# Altium schematic sheet Arduino_ Connectors.SchDoc: Arduino UNO connectors
size A4; Date: 29-OCT-2015; Author: A.B; CompanyName: STMicroelectronics; Organization: MCD/TOOLS/GNB; Address1: 12, Rue Jules HOROWITZ; Address2: 38019 Grenoble; Address3: FRANCE; DocumentNumber: MB1225; Revision: B-01; SheetNumber: 8; SheetTotal: 13; Project: STM32F769I-DISCO
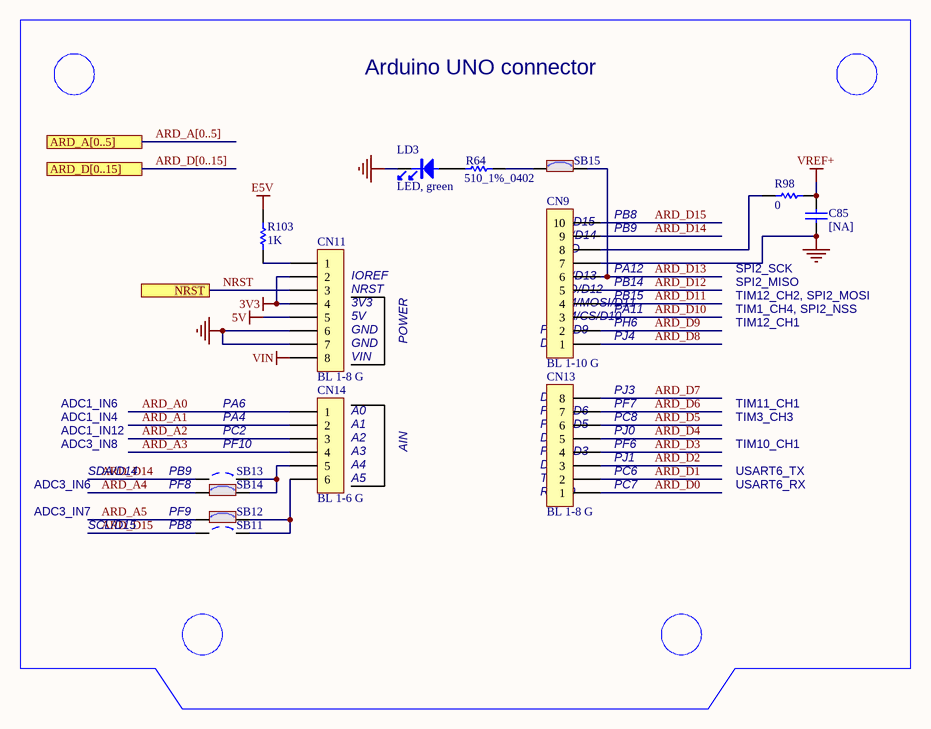
[diagram p0: Arduino_ Connectors.SchDoc]

## Parts
C85  [NA]  [0402C]
CN9  BL 1-10 G  [HDR_1X10_2R54_W]
CN11  BL 1-8 G  [HDR_1X8_2R54_W]
CN13  BL 1-8 G  [HDR_1X8_2R54_W]
CN14  BL 1-6 G  [HDR_1X6_2R54_W]
LD3  LED, green  [0603D]
R64  510_1%_0402  [0402R]
R98  0  [0402R]
R103  1K  [0402R]
SB11  Solder Bridge OFF  [JP2_SMD]  (value not drawn)
SB12  Solder Bridge ON  [JP2_SMD]  (value not drawn)
SB13  Solder Bridge OFF  [JP2_SMD]  (value not drawn)
SB14  Solder Bridge ON  [JP2_SMD]  (value not drawn)
SB15  Solder Bridge ON  [JP2_SMD]  (value not drawn)

## Ports
ARD_A[0..5], ARD_D[0..15], NRST

## Nets
3V3: CN11.2 CN11.4
5V: CN11.5
E5V: R103.2
GND: C85.1 CN9.7 CN11.6 CN11.7 LD3.2
VIN: CN11.8
VREF+: C85.2 R98.2
ARD_A0: CN14.1
ARD_A1: CN14.2
ARD_A2: CN14.3
ARD_A3: CN14.4
ARD_A4: SB14.1
ARD_A5: SB12.1
ARD_D0: CN13.1
ARD_D1: CN13.2
ARD_D2: CN13.3
ARD_D3: CN13.4
ARD_D4: CN13.5
ARD_D5: CN13.6
ARD_D6: CN13.7
ARD_D7: CN13.8
ARD_D8: CN9.1
ARD_D9: CN9.2
ARD_D10: CN9.3
ARD_D11: CN9.4
ARD_D12: CN9.5
ARD_D13: CN9.6 SB15.2
ARD_D14: CN9.9 SB13.1
ARD_D15: CN9.10 SB11.1
NRST: CN11.3 ; port NRST
NetCN9_8: CN9.8 R98.1
NetCN11_1: CN11.1 R103.1
NetCN14_5: CN14.5 SB13.2 SB14.2
NetCN14_6: CN14.6 SB11.2 SB12.2
NetLD3_1: LD3.1 R64.1
NetR64_2: R64.2 SB15.1

## Buses and harness runs
bus ARD_A[0..5] = port ARD_A[0..5]
bus ARD_D[0..15] = port ARD_D[0..15]

## Notes on the sheet
- Arduino UNO connector
- PB8
- (near CN11) IOREF
- (near CN11) NRST
- (near CN9) SDA/D14
- (near CN9) SCL/D15
- (near CN9) SCK/D13
- (near CN9) MISO/D12
- (near CN9) AVDD
- (near CN9) GND
- (near CN9) PB14
- (near CN9) PA12
- (near CN9) PB9
- SPI2_MISO
- SPI2_SCK
- (near CN11) 3V3
- (near CN11) 5V
- (near CN11) GND
- POWER
- (near CN9) D8
- (near CN9) PWM/D9
- (near CN9) PWM/CS/D10
- (near CN9) PWM/MOSI/D11
- (near CN9) PA11
- (near CN9) PJ4
- (near CN9) PH6
- (near CN9) PB15
- TIM12_CH1
- TIM1_CH4, SPI2_NSS
- TIM12_CH2, SPI2_MOSI
- ADC1_IN4
- ADC1_IN6
- PA6
- PA4
- (near CN14) A0
- (near CN14) A1
- (near CN11) VIN
- (near CN13) PWM/D5
- (near CN13) PWM/D6
- (near CN13) D7
- (near CN13) PF7
- PJ3
- (near CN13) PC8
- TIM3_CH3
- TIM11_CH1
- ADC3_IN6
- ADC3_IN8
- ADC1_IN12
- SDA/D14
- PB9
- PF8
- PC2
- PF10
- (near CN14) A2
- (near CN14) A3
- (near CN14) A4
- (near CN14) A5
- AIN
- (near CN13) TX/D1
- (near CN13) D2
- (near CN13) D4
- (near CN13) PWM/D3
- (near CN13) PC6
- (near CN13) PJ1
- (near CN13) PF6
- (near CN13) PJ0
- (near CN13) PC7
- USART6_RX
- USART6_TX
- TIM10_CH1
- ADC3_IN7
- SCL/D15
- PF9
- (near CN13) RX/D0
- Title:
- Project:
- Size:
- Revision:
- Variant:
- -
- Date:
- Reference:
- Sheet:
- of

## Library data of the parts
C85 = Cap_NA_0402: Capacitor,NA,0402; Fitted: NO; Revision: July-2002: Re-released for DXP Platform.; Value: [NA]; ECCN_US/EU: n/a
CN9 = Header 10X1_Female_THT: Header, 10-Pin, Single row, female, THT, 2.54; Manuf_1: Fischer Electronik; Manuf_Part_1: BL 1-10 G; Distrib: Sub Co; ECCN_US/EU: n/a
CN11 CN13 = Header 8X1_Female_THT: Header, 8-Pins, Single row, female, THT, 2.54; Manuf_1: Fischer Electronik; Manuf_Part_1: BL 1-8 G; Distrib: Sub Co; ECCN_US/EU: n/a
CN14 = Header 6X1_Female_THT: Header, 6-Pins, Single row, female THT, 2.54; Manuf_1: Fischer Electronik; Manuf_Part_1: BL 1-6 G; Distrib: Sub Co; ECCN_US/EU: n/a
LD3 = LED_green: LED, green, 0603; Manuf_1: everlight; Manuf_Part_1: 19-213SYGC/S530-E2/TR8; ECCN_US/EU: EAR99/NEC; Order: 19-213SYGC/S530-E2/TR8
R64 = Res_510_1%_0402: Resistor,510,0402,1%,YAGEO; Manuf_Part_1: RC0402FR-07510L; Value: 510; Manuf_1: YAGEO; Order: RC0402FR-07510L; ECCN_US/EU: n/a; Distrib: DIGIKEY
R98 = Res_0_5%_0402: Resistor,0,0402,5%,YAGEO; Manuf_Part_1: RC0402JR-070RL; Order: 2363467; Value: 0; ECCN_US/EU: n/a; Manuf_1: YAGEO; Distrib: FARNELL
R103 = Res_1K_1%_0402: Resistor,1K,0402,1%,YAGEO; Manuf_Part_1: RC0402FR-071KL; Value: 1K; Manuf_1: YAGEO; Order: RC0402FR-071KL; ECCN_US/EU: n/a
SB11 SB13 = SB_OFF: Solder: NO; Revision: July-2002: Re-released for DXP Platform.; ECCN_US/EU: n/a
SB12 SB14 SB15 = SB_ON: Solder: YES; Revision: July-2002: Re-released for DXP Platform.; ECCN_US/EU: n/a